# EAGLE schematic ControlBoard03_v01 (EAGLE 7.7.0), part 2 of 2
## Sheet 8 of 10: Negative VReg
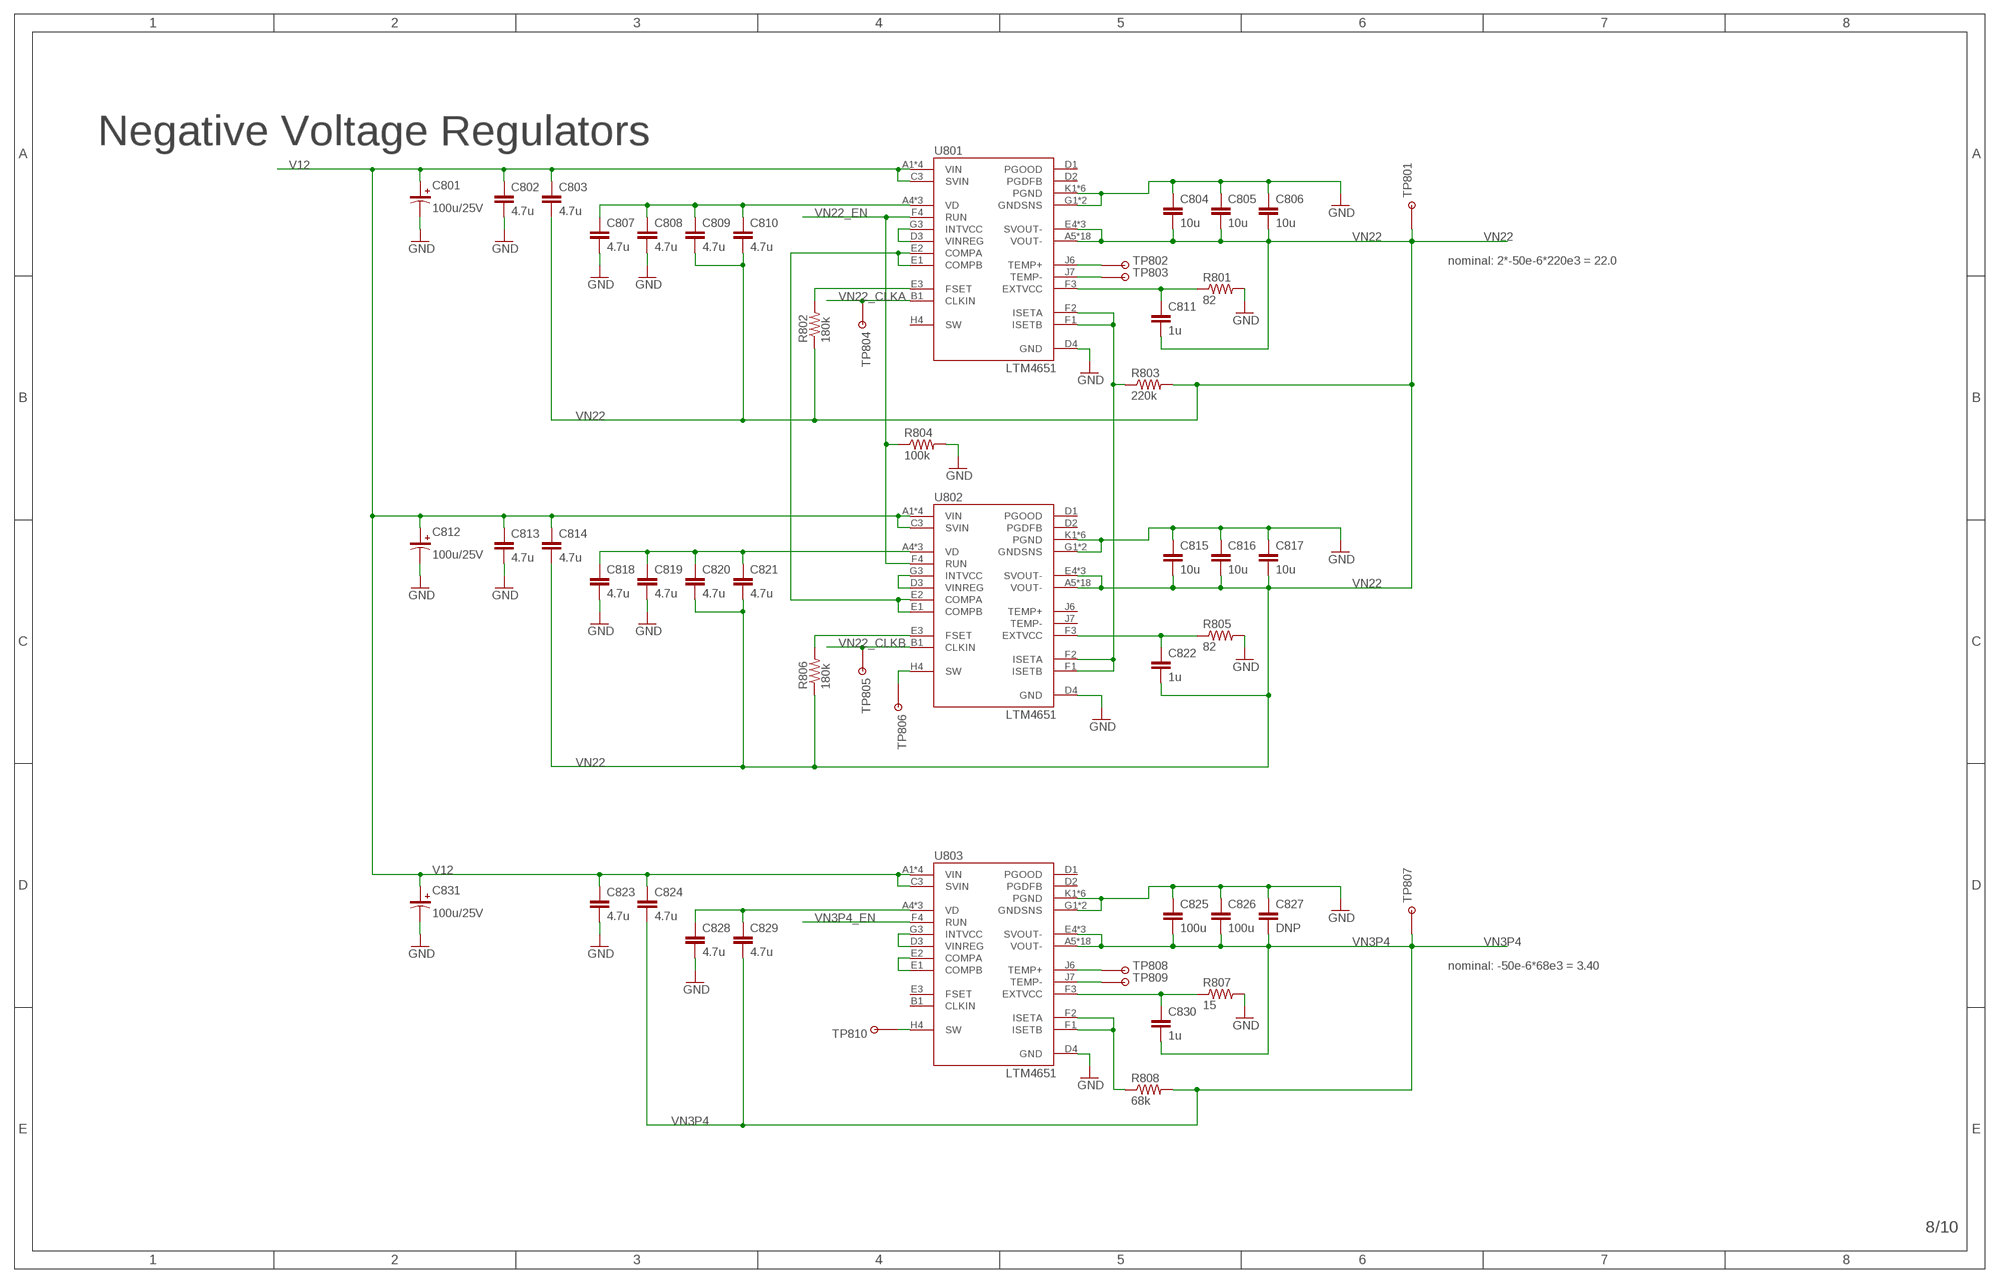
[diagram p7: schematic, sheet 8]

### Parts
C801  100u/25V  CAP-POL2917  [2917-CAP]
C802  4.7u  CAP0805-CAP  [0805-CAP]
C803  4.7u  CAP0805-CAP  [0805-CAP]
C804  10u  CAP1206  [1206]
C805  10u  CAP1206  [1206]
C806  10u  CAP1206  [1206]
C807  4.7u  CAP0805-CAP  [0805-CAP]
C808  4.7u  CAP0805-CAP  [0805-CAP]
C809  4.7u  CAP0805-CAP  [0805-CAP]
C810  4.7u  CAP0805-CAP  [0805-CAP]
C811  1u  CAP0603-CAP  [0603-CAP]
C812  100u/25V  CAP-POL2917  [2917-CAP]
C813  4.7u  CAP0805-CAP  [0805-CAP]
C814  4.7u  CAP0805-CAP  [0805-CAP]
C815  10u  CAP1206  [1206]
C816  10u  CAP1206  [1206]
C817  10u  CAP1206  [1206]
C818  4.7u  CAP0805-CAP  [0805-CAP]
C819  4.7u  CAP0805-CAP  [0805-CAP]
C820  4.7u  CAP0805-CAP  [0805-CAP]
C821  4.7u  CAP0805-CAP  [0805-CAP]
C822  1u  CAP0603-CAP  [0603-CAP]
C823  4.7u  CAP0805-CAP  [0805-CAP]
C824  4.7u  CAP0805-CAP  [0805-CAP]
C825  100u  CAP1206  [1206]
C826  100u  CAP1206  [1206]
C827  DNP  CAP1206  [1206]
C828  4.7u  CAP0805-CAP  [0805-CAP]
C829  4.7u  CAP0805-CAP  [0805-CAP]
C830  1u  CAP0603-CAP  [0603-CAP]
C831  100u/25V  CAP-POL2917  [2917-CAP]
R801  82  RESISTOR0402-RES  [0402-RES]
R802  180k  RESISTOR0402-RES  [0402-RES]
R803  220k  RESISTOR0402-RES  [0402-RES]
R804  100k  RESISTOR0402-RES  [0402-RES]
R805  82  RESISTOR0402-RES  [0402-RES]
R806  180k  RESISTOR0402-RES  [0402-RES]
R807  15  RESISTOR0402-RES  [0402-RES]
R808  68k  RESISTOR0402-RES  [0402-RES]
TP801  TESTPOINT_ROUND  [TESTPAD_ROUND]
TP802  TESTPOINT_ROUND  [TESTPAD_ROUND]
TP803  TESTPOINT_ROUND  [TESTPAD_ROUND]
TP804  TESTPOINT_ROUND  [TESTPAD_ROUND]
TP805  TESTPOINT_ROUND  [TESTPAD_ROUND]
TP806  TESTPOINT_ROUND  [TESTPAD_ROUND]
TP807  TESTPOINT_ROUND  [TESTPAD_ROUND]
TP808  TESTPOINT_ROUND  [TESTPAD_ROUND]
TP809  TESTPOINT_ROUND  [TESTPAD_ROUND]
TP810  TESTPOINT_ROUND  [TESTPAD_ROUND]
U801  LTM4651  [BGA-77]
U802  LTM4651  [BGA-77]
U803  LTM4651  [BGA-77]

### Nets
GND: C801.N C802.2 C804.1 C805.1 C806.1 C807.2 C808.2 C812.N C813.2 C815.1 C816.1 C817.1 C818.2 C819.2 C823.2 C825.1 C826.1 C827.1 C828.2 C831.N R801.2 R804.2 R805.2 R807.2 U801.D4(GND) U801.G1(GNDSNS) U801.H1(GNDSNS) U801.K1(PGND) U801.K2(PGND) U801.K3(PGND) U801.L1(PGND) U801.L2(PGND) U801.L3(PGND) U802.D4(GND) U802.G1(GNDSNS) U802.H1(GNDSNS) U802.K1(PGND) U802.K2(PGND) U802.K3(PGND) U802.L1(PGND) U802.L2(PGND) U802.L3(PGND) U803.D4(GND) U803.G1(GNDSNS) U803.H1(GNDSNS) U803.K1(PGND) U803.K2(PGND) U803.K3(PGND) U803.L1(PGND) U803.L2(PGND) U803.L3(PGND) ; also sheet 1,2,3,4,5,6,7,9,10
N$1: U803.D3(VINREG) U803.G3(INTVCC)
N$2: TP802.P$1 U801.J6(TEMP+)
N$5: U803.E1(COMPB) U803.E2(COMPA)
N$6: U801.D3(VINREG) U801.G3(INTVCC)
N$7: U801.E1(COMPB) U801.E2(COMPA) U802.E1(COMPB) U802.E2(COMPA)
N$9: R802.2 U801.E3(FSET)
N$12: TP803.P$1 U801.J7(TEMP-)
N$13: C811.1 R801.1 U801.F3(EXTVCC)
N$19: C822.1 R805.1 U802.F3(EXTVCC)
N$20: TP808.P$1 U803.J6(TEMP+)
N$21: TP809.P$1 U803.J7(TEMP-)
N$22: R803.1 U801.F1(ISETB) U801.F2(ISETA) U802.F1(ISETB) U802.F2(ISETA)
N$23: U802.D3(VINREG) U802.G3(INTVCC)
N$25: TP806.P$1 U802.H4(SW)
N$26: C830.1 R807.1 U803.F3(EXTVCC)
N$27: C807.1 C808.1 C809.1 C810.1 U801.A4(VD) U801.B4(VD) U801.C4(VD)
N$31: C818.1 C819.1 C820.1 C821.1 U802.A4(VD) U802.B4(VD) U802.C4(VD)
N$32: R806.2 U802.E3(FSET)
N$36: R808.1 U803.F1(ISETB) U803.F2(ISETA)
N$39: TP810.P$1 U803.H4(SW)
N$41: C828.1 C829.1 U803.A4(VD) U803.B4(VD) U803.C4(VD)
V12: C801.P C802.1 C803.1 C812.P C813.1 C814.1 C823.1 C824.1 C831.P U801.A1(VIN) U801.A2(VIN) U801.A3(VIN) U801.B3(VIN) U801.C3(SVIN) U802.A1(VIN) U802.A2(VIN) U802.A3(VIN) U802.B3(VIN) U802.C3(SVIN) U803.A1(VIN) U803.A2(VIN) U803.A3(VIN) U803.B3(VIN) U803.C3(SVIN) ; also sheet 2,6,7,9,10
VN3P4: C824.2 C825.2 C826.2 C827.2 C829.2 C830.2 R808.2 TP807.P$1 U803.A5(VOUT-) U803.B5(VOUT-) U803.C2(VOUT-) U803.C5(VOUT-) U803.D5(VOUT-) U803.E4(SVOUT-) U803.E5(VOUT-) U803.F5(VOUT-) U803.G2(SVOUT-) U803.G4(VOUT-) U803.G5(VOUT-) U803.H2(SVOUT-) U803.H3(VOUT-) U803.H5(VOUT-) U803.J3(VOUT-) U803.J4(VOUT-) U803.J5(VOUT-) U803.K4(VOUT-) U803.K5(VOUT-) U803.L4(VOUT-) U803.L5(VOUT-) ; also sheet 4,5
VN3P4_EN: U803.F4(RUN) ; also sheet 3
VN22: C803.2 C804.2 C805.2 C806.2 C809.2 C810.2 C811.2 C814.2 C815.2 C816.2 C817.2 C820.2 C821.2 C822.2 R802.1 R803.2 R806.1 TP801.P$1 U801.A5(VOUT-) U801.B5(VOUT-) U801.C2(VOUT-) U801.C5(VOUT-) U801.D5(VOUT-) U801.E4(SVOUT-) U801.E5(VOUT-) U801.F5(VOUT-) U801.G2(SVOUT-) U801.G4(VOUT-) U801.G5(VOUT-) U801.H2(SVOUT-) U801.H3(VOUT-) U801.H5(VOUT-) U801.J3(VOUT-) U801.J4(VOUT-) U801.J5(VOUT-) U801.K4(VOUT-) U801.K5(VOUT-) U801.L4(VOUT-) U801.L5(VOUT-) U802.A5(VOUT-) U802.B5(VOUT-) U802.C2(VOUT-) U802.C5(VOUT-) U802.D5(VOUT-) U802.E4(SVOUT-) U802.E5(VOUT-) U802.F5(VOUT-) U802.G2(SVOUT-) U802.G4(VOUT-) U802.G5(VOUT-) U802.H2(SVOUT-) U802.H3(VOUT-) U802.H5(VOUT-) U802.J3(VOUT-) U802.J4(VOUT-) U802.J5(VOUT-) U802.K4(VOUT-) U802.K5(VOUT-) U802.L4(VOUT-) U802.L5(VOUT-) ; also sheet 4
VN22_CLKA: TP804.P$1 U801.B1(CLKIN) ; also sheet 3
VN22_CLKB: TP805.P$1 U802.B1(CLKIN) ; also sheet 3
VN22_EN: R804.1 U801.F4(RUN) U802.F4(RUN) ; also sheet 3
Unconnected: U801.D1(PGOOD) U801.D2(PGDFB) U801.H4(SW) U802.D1(PGOOD) U802.D2(PGDFB) U802.J6(TEMP+) U802.J7(TEMP-) U803.B1(CLKIN) U803.D1(PGOOD) U803.D2(PGDFB) U803.E3(FSET)

### Notes on the sheet
- Negative Voltage Regulators
- nominal: 2*-50e-6*220e3 = 22.0
- nominal: -50e-6*68e3 = 3.40

## Sheet 9 of 10: Misc Power
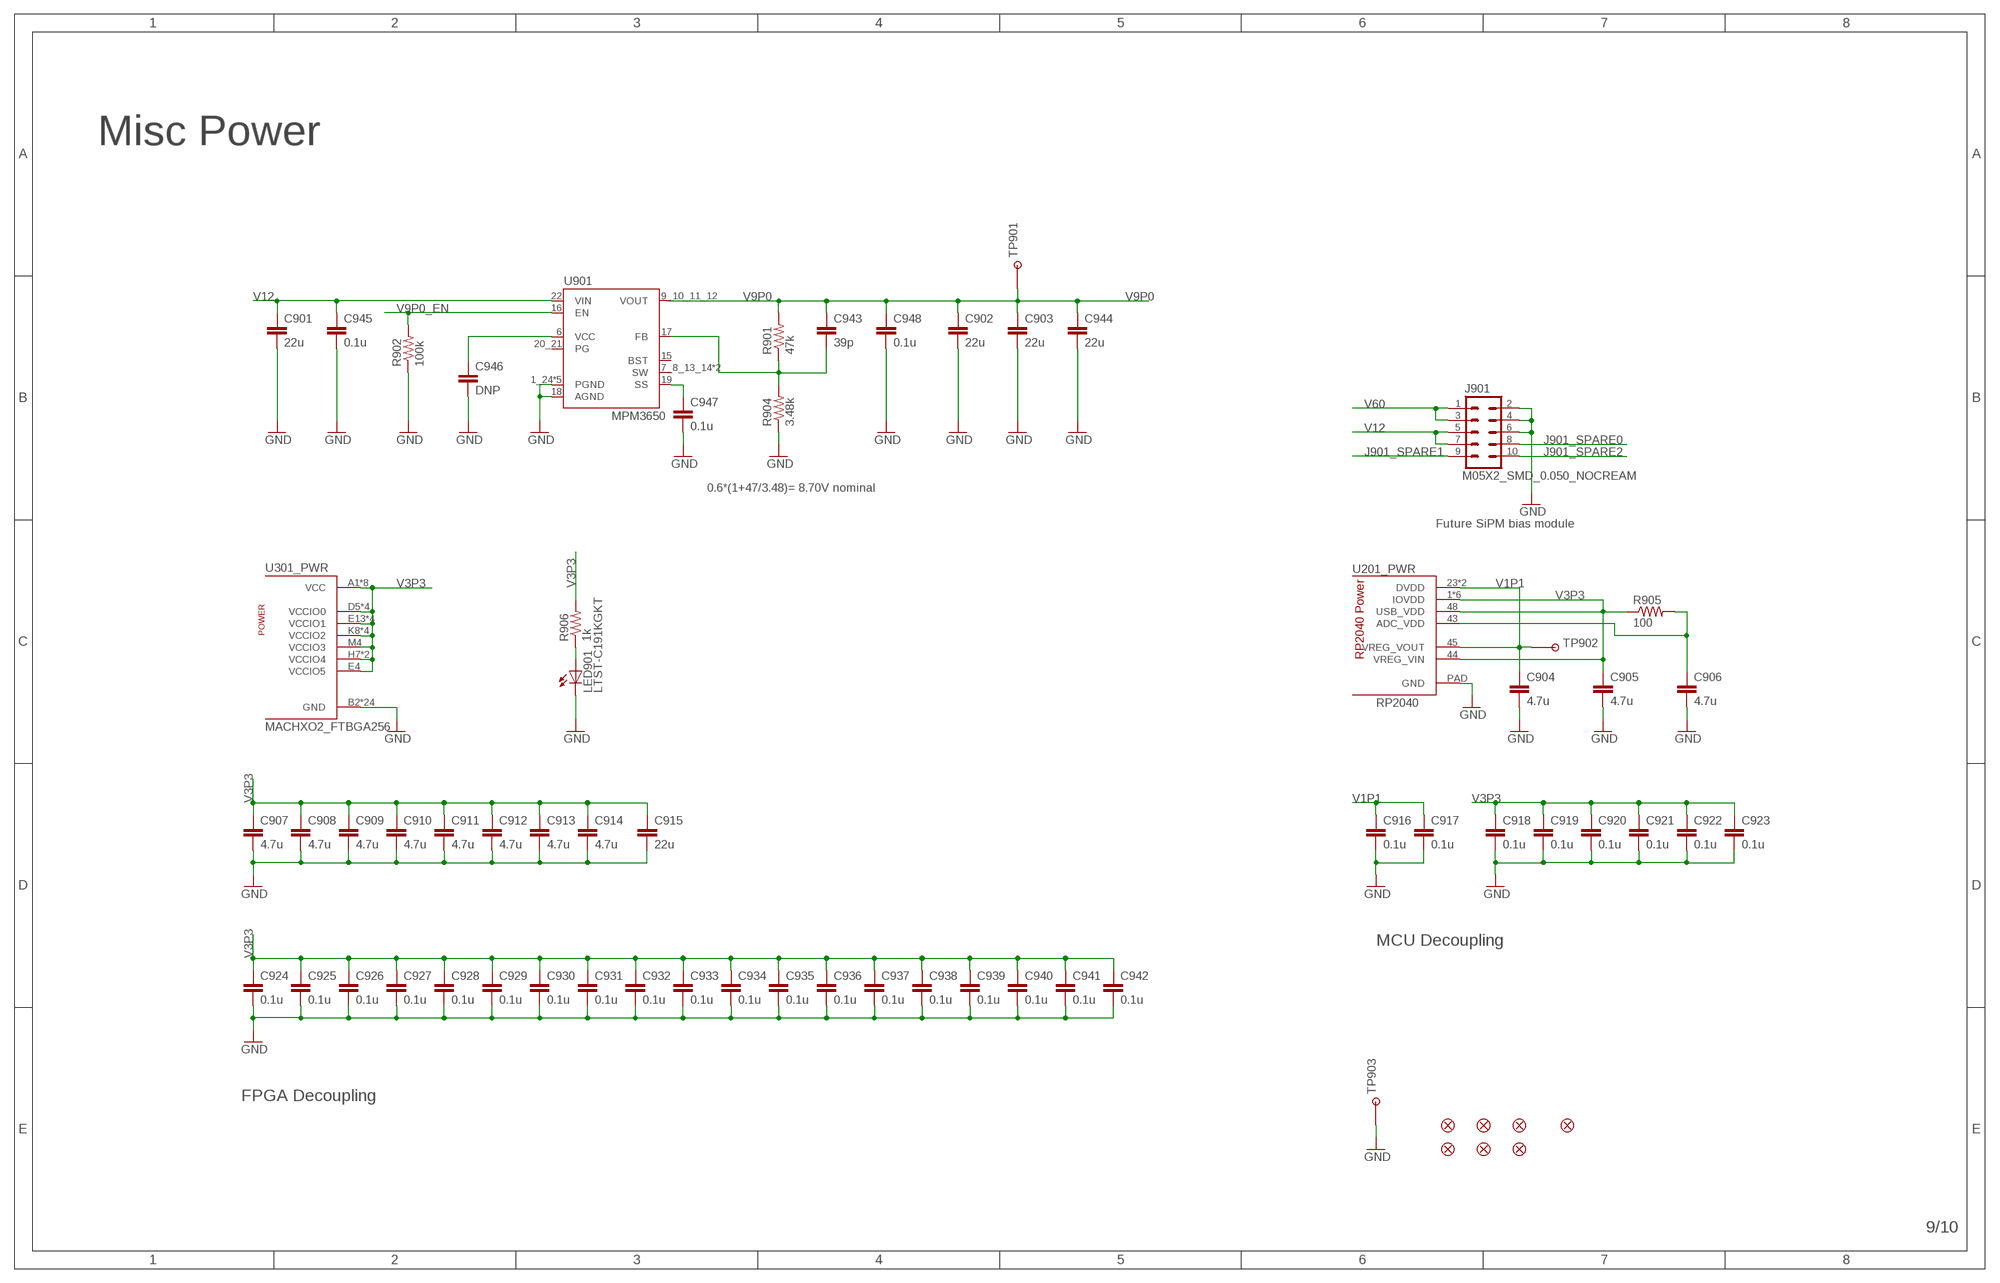
[diagram p8: schematic, sheet 9]

### Parts
C901  22u  CAP0805-CAP  [0805-CAP]
C902  22u  CAP0805-CAP  [0805-CAP]
C903  22u  CAP0805-CAP  [0805-CAP]
C904  4.7u  CAP0402-CAP  [0402-CAP]
C905  4.7u  CAP0402-CAP  [0402-CAP]
C906  4.7u  CAP0402-CAP  [0402-CAP]
C907  4.7u  CAP0402-CAP  [0402-CAP]
C908  4.7u  CAP0402-CAP  [0402-CAP]
C909  4.7u  CAP0402-CAP  [0402-CAP]
C910  4.7u  CAP0402-CAP  [0402-CAP]
C911  4.7u  CAP0402-CAP  [0402-CAP]
C912  4.7u  CAP0402-CAP  [0402-CAP]
C913  4.7u  CAP0402-CAP  [0402-CAP]
C914  4.7u  CAP0402-CAP  [0402-CAP]
C915  22u  CAP0805-CAP  [0805-CAP]
C916  0.1u  CAP0402-CAP  [0402-CAP]
C917  0.1u  CAP0402-CAP  [0402-CAP]
C918  0.1u  CAP0402-CAP  [0402-CAP]
C919  0.1u  CAP0402-CAP  [0402-CAP]
C920  0.1u  CAP0402-CAP  [0402-CAP]
C921  0.1u  CAP0402-CAP  [0402-CAP]
C922  0.1u  CAP0402-CAP  [0402-CAP]
C923  0.1u  CAP0402-CAP  [0402-CAP]
C924  0.1u  CAP0402-CAP  [0402-CAP]
C925  0.1u  CAP0402-CAP  [0402-CAP]
C926  0.1u  CAP0402-CAP  [0402-CAP]
C927  0.1u  CAP0402-CAP  [0402-CAP]
C928  0.1u  CAP0402-CAP  [0402-CAP]
C929  0.1u  CAP0402-CAP  [0402-CAP]
C930  0.1u  CAP0402-CAP  [0402-CAP]
C931  0.1u  CAP0402-CAP  [0402-CAP]
C932  0.1u  CAP0402-CAP  [0402-CAP]
C933  0.1u  CAP0402-CAP  [0402-CAP]
C934  0.1u  CAP0402-CAP  [0402-CAP]
C935  0.1u  CAP0402-CAP  [0402-CAP]
C936  0.1u  CAP0402-CAP  [0402-CAP]
C937  0.1u  CAP0402-CAP  [0402-CAP]
C938  0.1u  CAP0402-CAP  [0402-CAP]
C939  0.1u  CAP0402-CAP  [0402-CAP]
C940  0.1u  CAP0402-CAP  [0402-CAP]
C941  0.1u  CAP0402-CAP  [0402-CAP]
C942  0.1u  CAP0402-CAP  [0402-CAP]
C943  39p  CAP0402-CAP  [0402-CAP]
C944  22u  CAP0805-CAP  [0805-CAP]
C945  0.1u  CAP0402-CAP  [0402-CAP]
C946  DNP  CAP0402-CAP  [0402-CAP]
C947  0.1u  CAP0402-CAP  [0402-CAP]
C948  0.1u  CAP0402-CAP  [0402-CAP]
FID901  FIDUCIALUFIDUCIAL  [MICRO-FIDUCIAL]
FID902  FIDUCIALUFIDUCIAL  [MICRO-FIDUCIAL]
FID903  FIDUCIALUFIDUCIAL  [MICRO-FIDUCIAL]
FID904  FIDUCIALUFIDUCIAL  [MICRO-FIDUCIAL]
FID905  FIDUCIALUFIDUCIAL  [MICRO-FIDUCIAL]
FID906  FIDUCIALUFIDUCIAL  [MICRO-FIDUCIAL]
FID907  FIDUCIALUFIDUCIAL  [MICRO-FIDUCIAL]
J901  M05X2_SMD_0.050_NOCREAM  [M05X2_0.050_SMD_NO_CREAM]
LED901  LTST-C191KGKT  LED0603  [LED-0603]
R901  47k  RESISTOR0402-RES  [0402-RES]
R902  100k  RESISTOR0402-RES  [0402-RES]
R904  3.48k  RESISTOR0402-RES  [0402-RES]
R905  100  RESISTOR0402-RES  [0402-RES]
R906  1k  RESISTOR0402-RES  [0402-RES]
TP901  TESTPOINT_ROUND  [TESTPAD_ROUND]
TP902  TESTPOINT_ROUND  [TESTPAD_ROUND]
TP903  TESTPOINTTUR  [TURRET]
U901  MPM3650  [QFN-24-MPS_FULL_CREAM]

### Nets
GND: C901.2 C902.2 C903.2 C904.2 C905.2 C906.2 C907.2 C908.2 C909.2 C910.2 C911.2 C912.2 C913.2 C914.2 C915.2 C916.2 C917.2 C918.2 C919.2 C920.2 C921.2 C922.2 C923.2 C924.2 C925.2 C926.2 C927.2 C928.2 C929.2 C930.2 C931.2 C932.2 C933.2 C934.2 C935.2 C936.2 C937.2 C938.2 C939.2 C940.2 C941.2 C942.2 C944.2 C945.2 C946.2 C947.2 C948.2 J901.2 J901.4 J901.6 LED901.C R902.1 R904.1 TP903.P$1 U201.PAD(_PWR:GND) U301.B2(_PWR:GND) U301.B15(_PWR:GND) U301.C3(_PWR:GND) U301.C14(_PWR:GND) U301.D4(_PWR:GND) U301.D13(_PWR:GND) U301.E5(_PWR:GND) U301.E12(_PWR:GND) U301.F6(_PWR:GND) U301.F11(_PWR:GND) U301.H8(_PWR:GND) U301.H9(_PWR:GND) U301.J8(_PWR:GND) U301.J9(_PWR:GND) U301.L6(_PWR:GND) U301.L11(_PWR:GND) U301.M5(_PWR:GND) U301.M12(_PWR:GND) U301.N4(_PWR:GND) U301.N13(_PWR:GND) U301.P3(_PWR:GND) U301.P14(_PWR:GND) U301.R2(_PWR:GND) U301.R15(_PWR:GND) U901.1_24(PGND) U901.2(PGND) U901.3(PGND) U901.4(PGND) U901.5(PGND) U901.18(AGND) ; also sheet 1,2,3,4,5,6,7,8,10
J901_SPARE0: J901.8 ; also sheet 3
J901_SPARE1: J901.9 ; also sheet 3
J901_SPARE2: J901.10 ; also sheet 3
N$8: C947.1 U901.19(SS)
N$15: LED901.A R906.1
N$43: C906.1 R905.2 U201.43(_PWR:ADC_VDD)
N$51: C946.1 U901.6(VCC)
N$67: C943.2 R901.1 R904.2 U901.17(FB)
V1P1: C904.1 C916.1 C917.1 TP902.P$1 U201.23(_PWR:DVDD) U201.45(_PWR:VREG_VOUT) U201.50(_PWR:DVDD)
V3P3: C905.1 C907.1 C908.1 C909.1 C910.1 C911.1 C912.1 C913.1 C914.1 C915.1 C918.1 C919.1 C920.1 C921.1 C922.1 C923.1 C924.1 C925.1 C926.1 C927.1 C928.1 C929.1 C930.1 C931.1 C932.1 C933.1 C934.1 C935.1 C936.1 C937.1 C938.1 C939.1 C940.1 C941.1 C942.1 R905.1 R906.2 U201.1(_PWR:IOVDD) U201.10(_PWR:IOVDD) U201.22(_PWR:IOVDD) U201.33(_PWR:IOVDD) U201.42(_PWR:IOVDD) U201.44(_PWR:VREG_VIN) U201.48(_PWR:USB_VDD) U201.49(_PWR:IOVDD) U301.A1(_PWR:VCC) U301.A16(_PWR:VCC) U301.D5(_PWR:VCCIO0) U301.D12(_PWR:VCCIO0) U301.E4(_PWR:VCCIO5) U301.E13(_PWR:VCCIO1) U301.G7(_PWR:VCC) U301.G8(_PWR:VCCIO0) U301.G9(_PWR:VCCIO0) U301.G10(_PWR:VCC) U301.H7(_PWR:VCCIO4) U301.H10(_PWR:VCCIO1) U301.J7(_PWR:VCCIO4) U301.J10(_PWR:VCCIO1) U301.K7(_PWR:VCC) U301.K8(_PWR:VCCIO2) U301.K9(_PWR:VCCIO2) U301.K10(_PWR:VCC) U301.M4(_PWR:VCCIO3) U301.M13(_PWR:VCCIO1) U301.N5(_PWR:VCCIO2) U301.N12(_PWR:VCCIO2) U301.T1(_PWR:VCC) U301.T16(_PWR:VCC) ; also sheet 2,3,5,6,7,10
V9P0: C902.1 C903.1 C943.1 C944.1 C948.1 R901.2 TP901.P$1 U901.9_10_11_12(VOUT) ; also sheet 4
V9P0_EN: R902.2 U901.16(EN) ; also sheet 3
V12: C901.1 C945.1 J901.5 J901.7 U901.22(VIN) ; also sheet 2,6,7,8,10
V60: J901.1 J901.3 ; also sheet 4
Unconnected: U901.7_8_13_14(SW) U901.15(BST) U901.20_21(PG) U901.23(SW)

### Notes on the sheet
- Misc Power
- 0.6*(1+47/3.48)= 8.70V nominal
- Future SiPM bias module
- MCU Decoupling
- FPGA Decoupling

## Sheet 10 of 10: Current Monitors
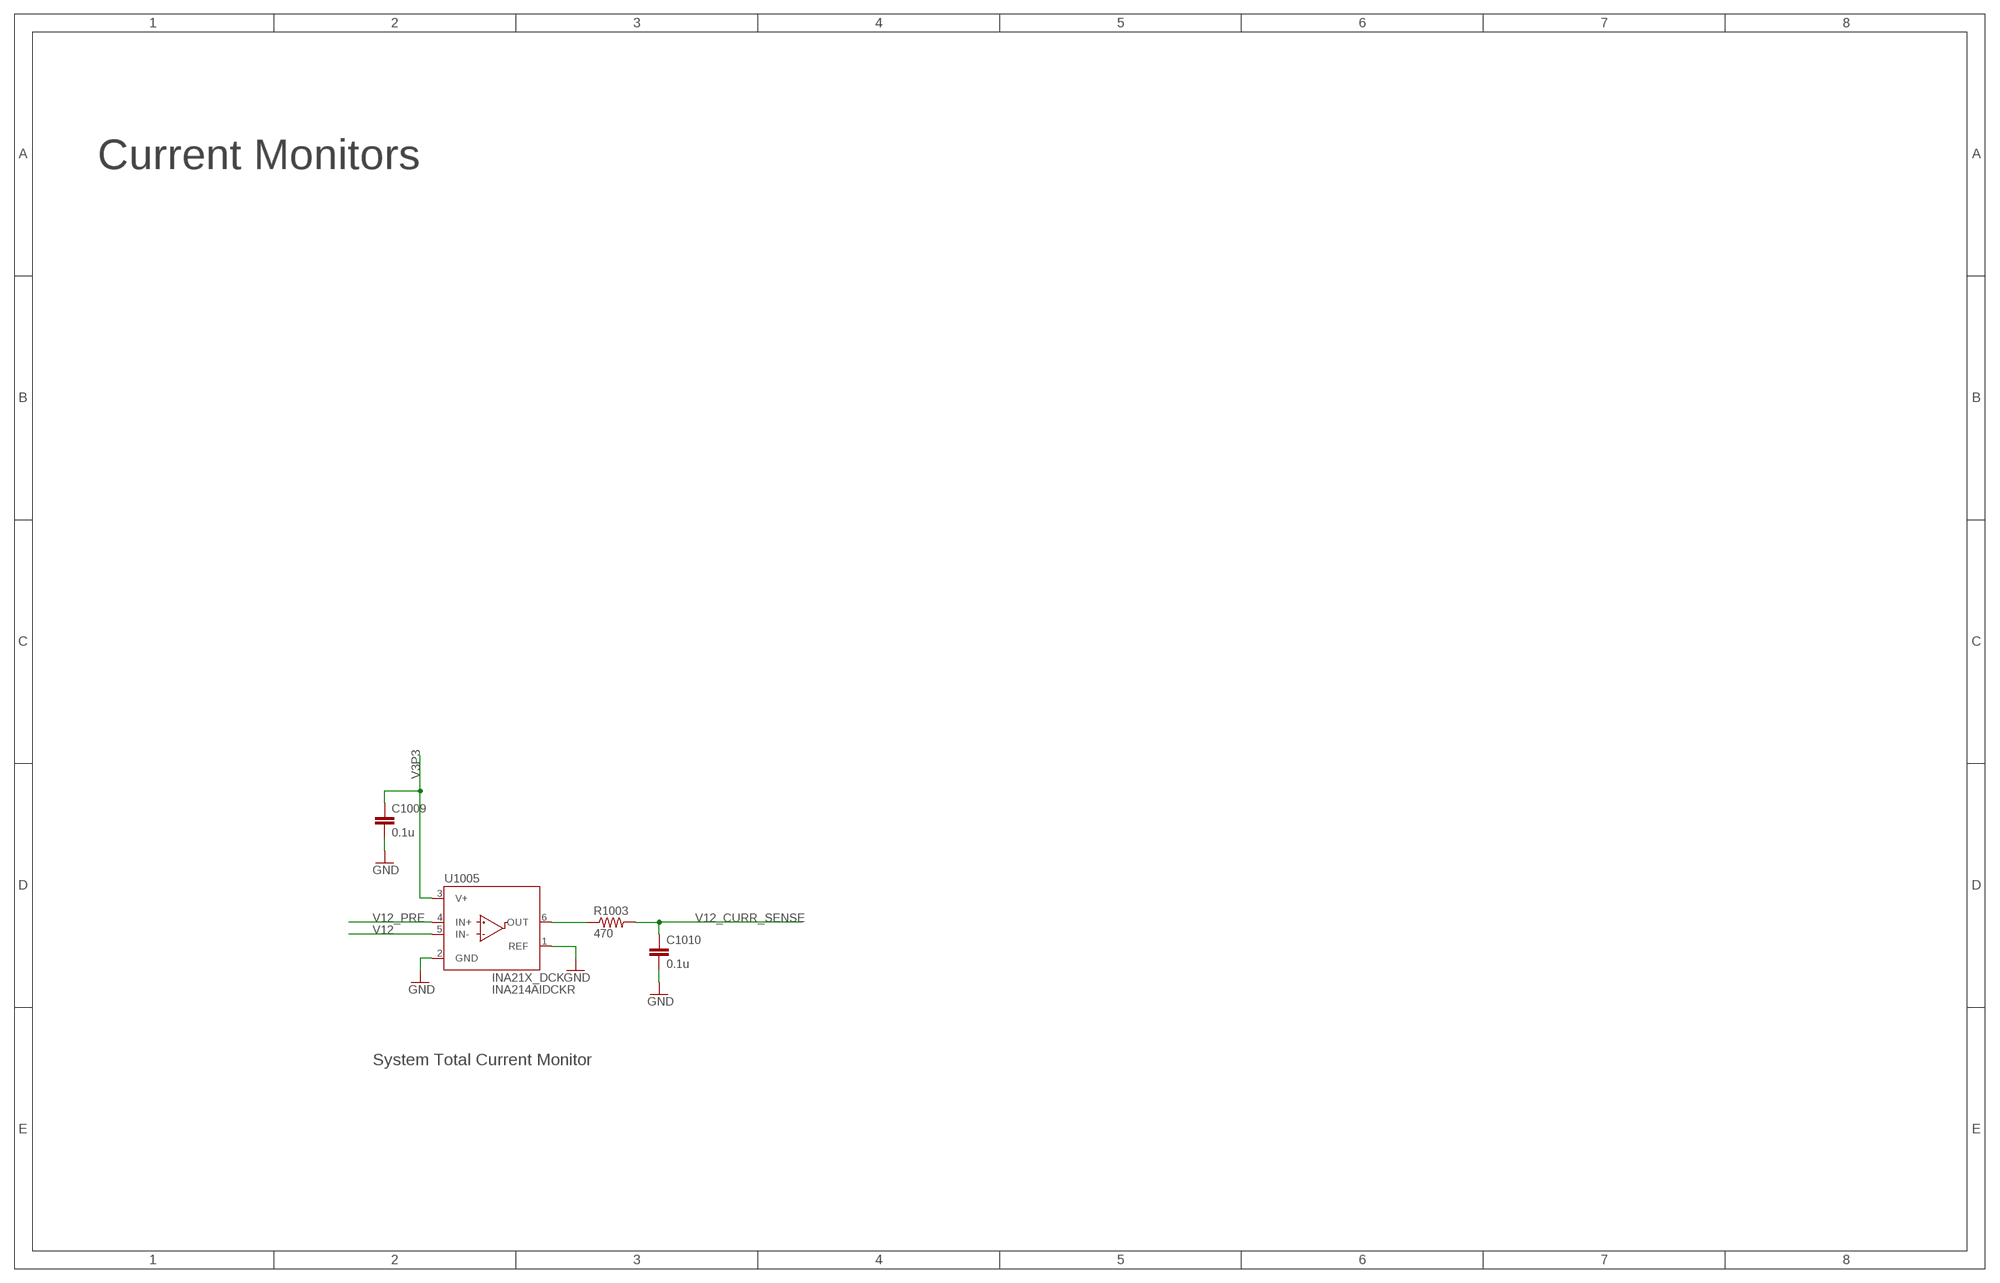
[diagram p9: schematic, sheet 10]

### Parts
C1009  0.1u  CAP0402-CAP  [0402-CAP]
C1010  0.1u  CAP0402-CAP  [0402-CAP]
R1003  470  RESISTOR0402-RES  [0402-RES]
U1005  INA21X_DCK  [SOT363]

### Nets
GND: C1009.2 C1010.2 U1005.1(REF) U1005.2(GND) ; also sheet 1,2,3,4,5,6,7,8,9
N$78: R1003.1 U1005.6(OUT)
V3P3: C1009.1 U1005.3(V+) ; also sheet 2,3,5,6,7,9
V12: U1005.5(IN-) ; also sheet 2,6,7,8,9
V12_CURR_SENSE: C1010.1 R1003.2 ; also sheet 2
V12_PRE: U1005.4(IN+) ; also sheet 7

### Notes on the sheet
- Current Monitors
- INA214AIDCKR
- System Total Current Monitor

## Library data of the parts
C101 C201-C208 C301 C501-C510 C601-C626 C701-C704 C706 C709-C717 C719-C730 C732-C740 C802-C811 C813-C830 C901-C948 C1009 C1010 = MyLib:CAP: Capacitor Standard 0603 ceramic capacitor, and 0.1" leaded capacitor.
C705 C707 C708 C718 C731 C801 C812 C831 = MyLib:CAP-POL
D101 D201 D202 D204 D501-D503 D602 = MyLib:D1213A-02SO: TVS 2 channel, steering diodes, 3.3V typ
D203 D205 D701-D704 = MyLib:DIODE
D601 = MyLib:PACDN042: Transient Voltage Suppressors and ESD Protectors 5.5V reverse stand-off
F101 F201-F204 F701 = MyLib:FUSE
FID901-FID907 = MyLib:FIDUCIAL: Fiducial Alignment Points Various fiducial points for machine vision alignment.
J101 J401-J405 = MyLib:M20X2
J102 J103 J201 J202 = MyLib:M04X1
J203 J601 = MyLib:USB-MICRO: USB - micro B USB 2.0 Receptacle Connector solder retention 609-4618-2-ND
J204 J205 J301 J602 J701 = MyLib:M04X2
J206 J208 = SparkFun-Connectors:M03: Header 3 Standard 3-pin 0.1" header. Use with straight break away headers (SKU : PRT-00116), right angle break away headers (PRT-00553), swiss pins (PRT-00743), machine pins (PRT-00117), and female headers (PRT-00115). Molex polarized connector foot print use with SKU : PRT-08232 with associated crimp pins and housings.
J207 = MyLib:M03X1
J302 = MyLib:M03X2
J303 J304 J901 = MyLib:M05X2: Header M05X2 SMD_0.050: Sullind GRPB052VWQS-RC DigiKey S9012E-05-ND
J501-J506 = MyLib:SMA: SMA Antenna Connector End launch SMA connector. The paste layer has been removed so that the connector can be hand soldered onto the board after reflow.
J507 = MyLib:U.FL: Hirose U.FL Coax 6GHz e.g. H9161CT-ND
J603 = MyLib:M13X2: Header 26 Positions SHF-113-01-L-D-SM SAM10712-ND
J604 = MyLib:M07X1
J702 = MyLib:POWERJACK
LED101 LED102 LED201-LED203 LED301-LED306 LED601-LED606 LED901 = MyLib:LED: LEDs Standard schematic elements and footprints for 5mm, 3mm, 1206, and 0603 sized LEDs. 5mm - Spark Fun Electronics SKU : COM-00529 (and others)
LF501 LF601-LF603 LF701 = MyLib:FERRITE: Ferrite e.g. 445-1561-1-ND
LS601 = SnapEDA:PKMCS0909E4000-R1: Audio Sounder Piezo Solder Pad Surface Mount; DESCRIPTION: Audio Sounder Piezo Solder Pad Surface Mount; DIGI-KEY_PART_NUMBER: 490-9647-1-ND; DIGI-KEY_PURCHASE_URL: https://www.digikey.com/product-detail/en/murata-electronics/PKMCS0909E4000-R1/490-9647-1-ND/4878401?utm_source=snapeda&utm_medium=aggregator&utm_campaign=symbol; MF: Murata; MP: PKMCS0909E4000-R1; PACKAGE: 2010 Murata
Q201 Q202 Q701 = MyLib:MOSFET-NCHANNEL
Q702 = MyLib:MOSFET-PCHANNEL: e.g. DMP2035U SO8: Si4431CDY
R101-R105 R201-R228 R301-R314 R401-R408 R501-R521 R601-R619 R702-R712 R714-R721 R723 R724 R801-R808 R901 R902 R904-R906 R1003 = MyLib:RESISTOR: Resistor Basic schematic elements and footprints for 0603, 1206, and PTH resistors.
S101 S201 S202 = MyLib:SWITCH-MOMENTARY-2: Various NO switches- pushbuttons, reed, etc
TP201 TP202 TP301-TP303 TP501 TP502 TP601 TP602 TP701-TP706 TP801-TP810 TP901-TP903 = MyLib:TESTPOINT
U201 = MyLib:RP2040: RP2040 Raspberry Pi Pico Microcontroller
U202 = MyLib:W25Q: Flash, Serial e.g. W25Q16JVUXIQ
U301 = MyLib:MACHXO2_FTBGA256: FPGA Lattice Semiconductor based on MACHXO2-1200U check pin compatibility for higher end models
U501 U503 = MyLib:ADS7886: ADC 12bit 1MSPS e.g. 296-19306-1-ND
U502 = MyLib:LTC2051HV: Zero-Drift Operational Amplifiers; MPN: LTC2051HVIMS8#PBF; OC_FARNELL: 1663679; OC_NEWARK: 56M4634; PACKAGE: MSOP-8; SUPPLIER: Linear Technology
U504 = MyLib:REF30XX
U505 = MyLib:ADP7182: Negative LDO
U601 = MyLib:MCP1755: LDO 16V 300 mA e.g. MCP1755-3302E/MC-ND
U602 = MyLib:93LC56: IC EEPROM 2K SPI 2MHZ SOT23-6 e.g. 93LC56BT-I/OTCT-ND
U603 = MyLib:APS6404L: PSRAM SPI/QPI APmemory e.g. APS6404L-3SQR-ZR 64Mbit 3V
U604 = SnapEDA:FT2232HQ: USB Hi-Speed to Dual Channel Serial UART/FIFO/JTAG/SPI/I2C IC - QFN-64
U605 U606 = MyLib:ISO7742: Digital Isolator, Quad Channel, 100Mbps, 5000V
U701 U704 U901 = MyLib:MPM3650: Step Down Module, 17Vin, 6A Monolithic Power Systems (pin compatible Recom part might be available)
U702 U703 U705 = MyLib:RPL-30: DC/DC Converter Recom RPL-3.0 3A 0.8-5.2V out, 4-18V in
U801-U803 = MyLib:LTM4651: DC/DC uModule, Inverting Output, 24W
U1005 = MyLib:INA21X: Current Sense Amplifier, high-side, zero-drift INA210, INA211, INA212, INA213, INA214, INA215
X201 X601 = MyLib:CRYSTAL-3.2-2.5: SMD Quartz Crystal e.g. CTS Series 403
XO301 = MyLib:OSCILLATOR: HCMOS Clock Oscillator